# EAGLE schematic BMC2267ltcvV1.0Proto (EAGLE 5.11)
HERSTBEZ: 74451222; MPN: 25C320/SN

## Sheet 1 of 2
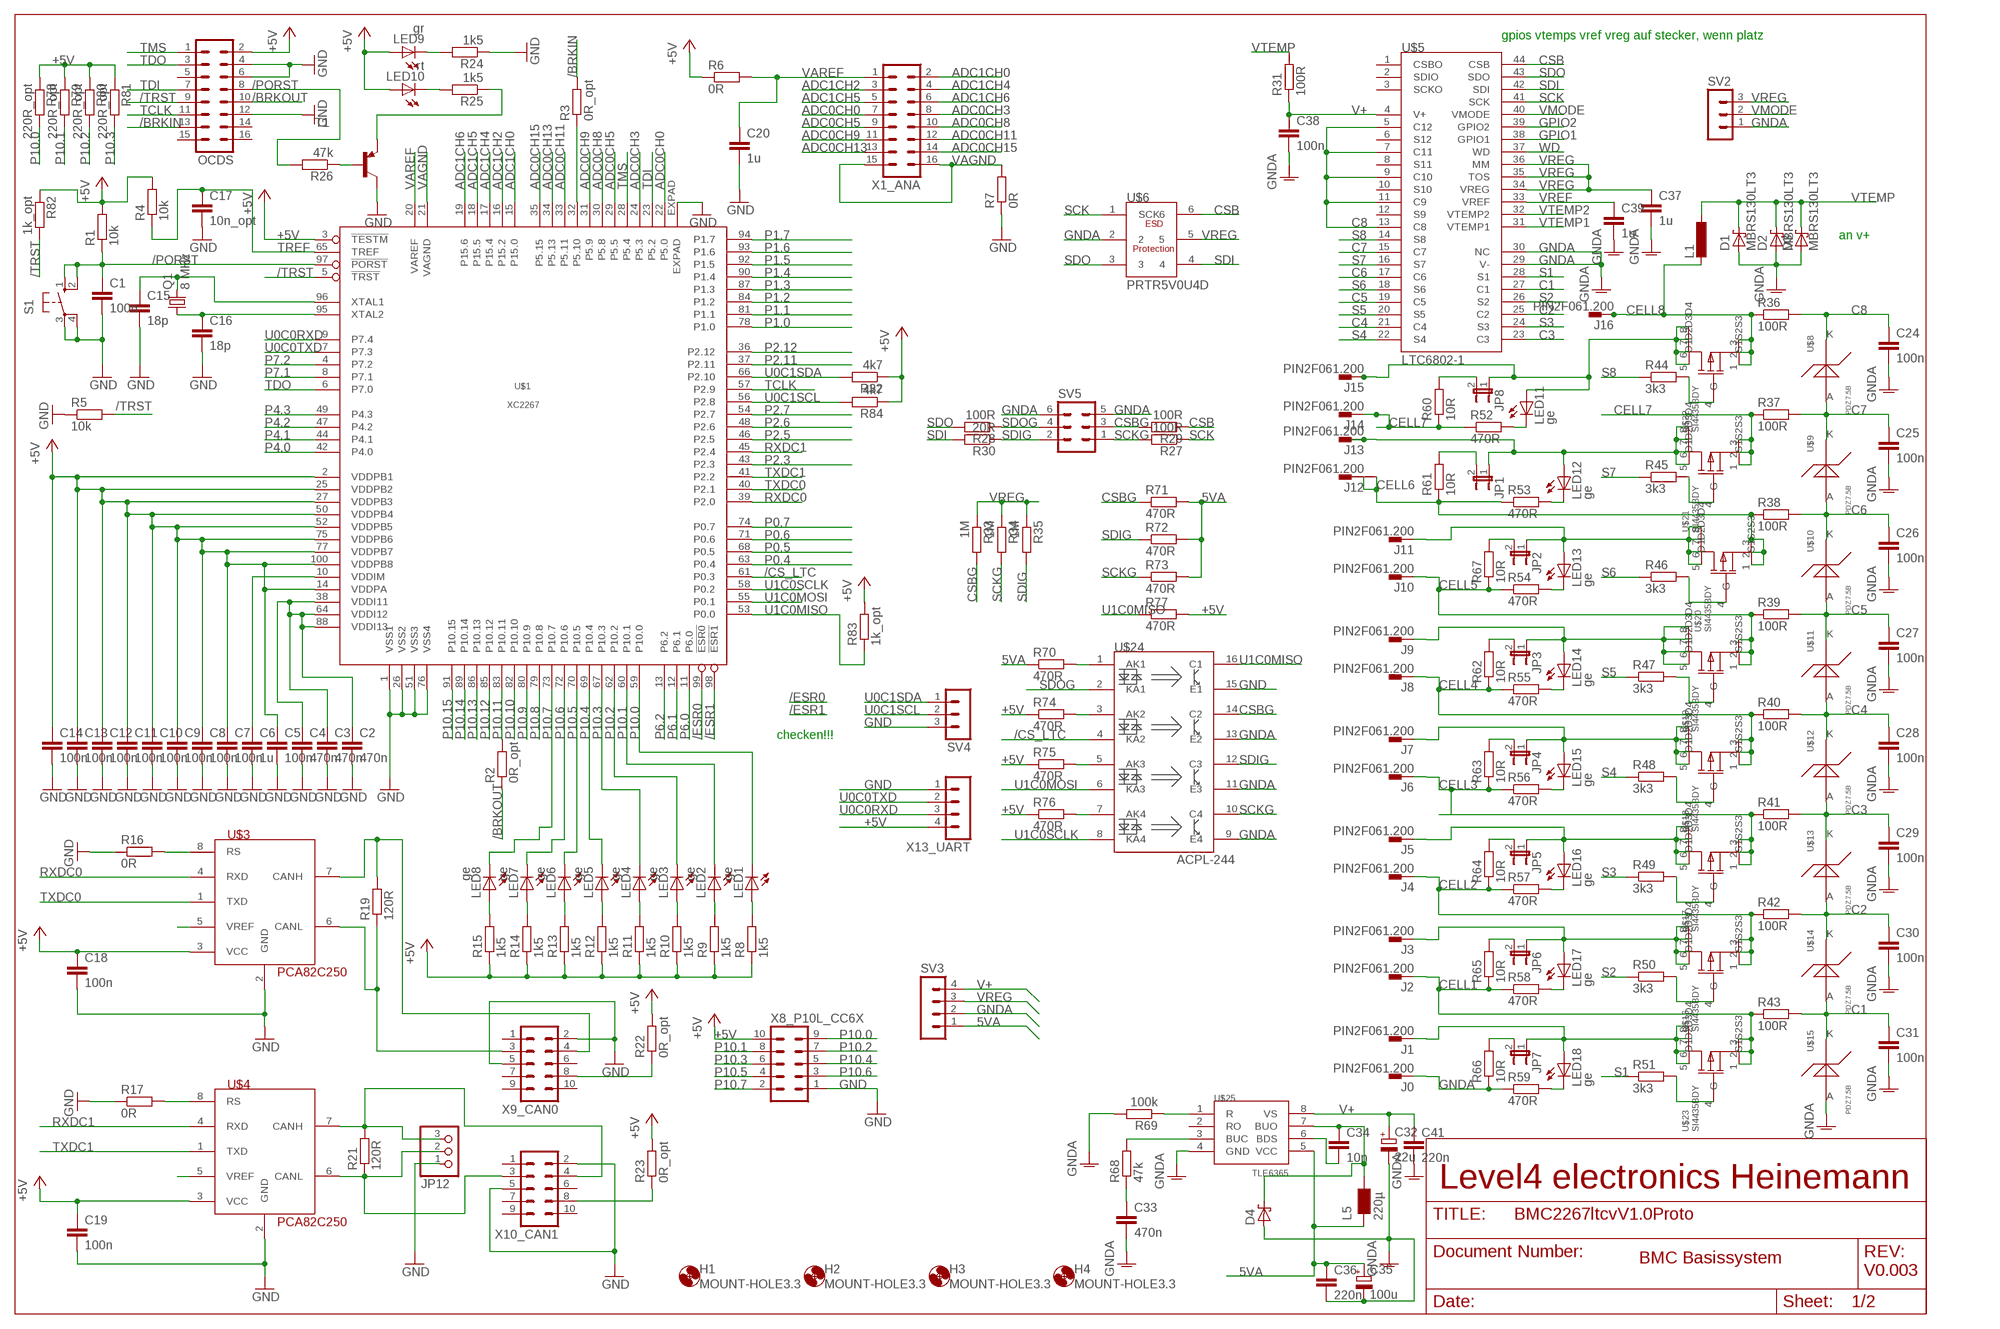
[diagram p0: schematic, sheet 1]

### Parts
C1  100n  C-EUC0805  [C0805]
C2  470n  C-EUC0805  [C0805]
C3  470n  C-EUC0805  [C0805]
C4  470n  C-EUC0805  [C0805]
C5  100n  C-EUC0805  [C0805]
C6  1u  C-EUC0805  [C0805]
C7  100n  C-EUC0603K  [C0603K]
C8  100n  C-EUC0603K  [C0603K]
C9  100n  C-EUC0603K  [C0603K]
C10  100n  C-EUC0603K  [C0603K]
C11  100n  C-EUC0603K  [C0603K]
C12  100n  C-EUC0603K  [C0603K]
C13  100n  C-EUC0603K  [C0603K]
C14  100n  C-EUC0603K  [C0603K]
C15  18p  C-EUC0805  [C0805]
C16  18p  C-EUC0805  [C0805]
C17  10n_opt  C-EUC0805  [C0805]
C18  100n  C-EUC0805  [C0805]
C19  100n  C-EUC0805  [C0805]
C20  1u  C-EUC0805  [C0805]
C24  100n  C-EUC0805  [C0805]
C25  100n  C-EUC0805  [C0805]
C26  100n  C-EUC0805  [C0805]
C27  100n  C-EUC0805  [C0805]
C28  100n  C-EUC0805  [C0805]
C29  100n  C-EUC0805  [C0805]
C30  100n  C-EUC0805  [C0805]
C31  100n  C-EUC0805  [C0805]
C32  22u  CPOL-EUCT6032  [CT6032]
C33  470n  C-EUC0805  [C0805]
C34  10n  C-EUC0805  [C0805]
C35  100u  CPOL-EUCT6032  [CT6032]
C36  220n  C-EUC0805  [C0805]
C37  1u  C-EUC0805  [C0805]
C38  100n  C-EUC0805  [C0805]
C39  1u  C-EUC0805  [C0805]
C41  220n  C-EUC0805  [C0805]
D1  MBRS130LT3  [SMB]
D2  MBRS130LT3  [SMB]
D3  MBRS130LT3  [SMB]
D4  SCHOTTKY-DIODESMD  [SMB]
H1  MOUNT-HOLE3.3  [3,3]
H2  MOUNT-HOLE3.3  [3,3]
H3  MOUNT-HOLE3.3  [3,3]
H4  MOUNT-HOLE3.3  [3,3]
J0  PIN2F061.200  [F061.200]
J1  PIN2F061.200  [F061.200]
J2  PIN2F061.200  [F061.200]
J3  PIN2F061.200  [F061.200]
J4  PIN2F061.200  [F061.200]
J5  PIN2F061.200  [F061.200]
J6  PIN2F061.200  [F061.200]
J7  PIN2F061.200  [F061.200]
J8  PIN2F061.200  [F061.200]
J9  PIN2F061.200  [F061.200]
J10  PIN2F061.200  [F061.200]
J11  PIN2F061.200  [F061.200]
J12  PIN2F061.200  [F061.200]
J13  PIN2F061.200  [F061.200]
J14  PIN2F061.200  [F061.200]
J15  PIN2F061.200  [F061.200]
J16  PIN2F061.200  [F061.200]
JP1  JP1E  [JP1]
JP2  JP1E  [JP1]
JP3  JP1E  [JP1]
JP4  JP1E  [JP1]
JP5  JP1E  [JP1]
JP6  JP1E  [JP1]
JP7  JP1E  [JP1]
JP8  JP1E  [JP1]
JP12  PINHD-1X3/90  [1X03/90]
L1  L-EUL3216C  [L3216C]
L5  220µ  WE-PD3_S  [S]
LED1  ge  LEDCHIP-LED0603  [CHIP-LED0603]
LED2  ge  LEDCHIP-LED0603  [CHIP-LED0603]
LED3  ge  LEDCHIP-LED0603  [CHIP-LED0603]
LED4  ge  LEDCHIP-LED0603  [CHIP-LED0603]
LED5  ge  LEDCHIP-LED0603  [CHIP-LED0603]
LED6  ge  LEDCHIP-LED0603  [CHIP-LED0603]
LED7  ge  LEDCHIP-LED0603  [CHIP-LED0603]
LED8  ge  LEDCHIP-LED0603  [CHIP-LED0603]
LED9  gr  LEDCHIP-LED0603  [CHIP-LED0603]
LED10  rt  LEDCHIP-LED0603  [CHIP-LED0603]
LED11  ge  LEDCHIP-LED0603  [CHIP-LED0603]
LED12  ge  LEDCHIP-LED0603  [CHIP-LED0603]
LED13  ge  LEDCHIP-LED0603  [CHIP-LED0603]
LED14  ge  LEDCHIP-LED0603  [CHIP-LED0603]
LED15  ge  LEDCHIP-LED0603  [CHIP-LED0603]
LED16  ge  LEDCHIP-LED0603  [CHIP-LED0603]
LED17  ge  LEDCHIP-LED0603  [CHIP-LED0603]
LED18  ge  LEDCHIP-LED0603  [CHIP-LED0603]
OCDS  MA08-2  [MA08-2]
Q1  8 MHz  CRYSTALSM49  [SM49]
R1  10k  R-EU_R0805  [R0805]
R2  0R_opt  R-EU_R0805  [R0805]
R3  0R_opt  R-EU_R0805  [R0805]
R4  10k  R-EU_R0805  [R0805]
R5  10k  R-EU_R0805  [R0805]
R6  0R  R-EU_R0805  [R0805]
R7  0R  R-EU_R0805  [R0805]
R8  1k5  R-EU_R0805  [R0805]
R9  1k5  R-EU_R0805  [R0805]
R10  1k5  R-EU_R0805  [R0805]
R11  1k5  R-EU_R0805  [R0805]
R12  1k5  R-EU_R0805  [R0805]
R13  1k5  R-EU_R0805  [R0805]
R14  1k5  R-EU_R0805  [R0805]
R15  1k5  R-EU_R0805  [R0805]
R16  0R  R-EU_R0805  [R0805]
R17  0R  R-EU_R0805  [R0805]
R19  120R  R-EU_R0805  [R0805]
R21  120R  R-EU_R0805  [R0805]
R22  0R_opt  R-EU_R0805  [R0805]
R23  0R_opt  R-EU_R0805  [R0805]
R24  1k5  R-EU_R0805  [R0805]
R25  1k5  R-EU_R0805  [R0805]
R26  47k  R-EU_R0805  [R0805]
R27  100R  R-EU_R0805  [R0805]
R28  100R  R-EU_R0805  [R0805]
R29  100R  R-EU_R0805  [R0805]
R30  20R  R-EU_R0805  [R0805]
R31  100R  R-EU_R0805  [R0805]
R32  4k7  R-EU_R0805  [R0805]
R33  1M  R-EU_R0805  [R0805]
R34  1M  R-EU_R0805  [R0805]
R35  1M  R-EU_R0805  [R0805]
R36  100R  R-EU_R0805  [R0805]
R37  100R  R-EU_R0805  [R0805]
R38  100R  R-EU_R0805  [R0805]
R39  100R  R-EU_R0805  [R0805]
R40  100R  R-EU_R0805  [R0805]
R41  100R  R-EU_R0805  [R0805]
R42  100R  R-EU_R0805  [R0805]
R43  100R  R-EU_R0805  [R0805]
R44  3k3  R-EU_R0805  [R0805]
R45  3k3  R-EU_R0805  [R0805]
R46  3k3  R-EU_R0805  [R0805]
R47  3k3  R-EU_R0805  [R0805]
R48  3k3  R-EU_R0805  [R0805]
R49  3k3  R-EU_R0805  [R0805]
R50  3k3  R-EU_R0805  [R0805]
R51  3k3  R-EU_R0805  [R0805]
R52  470R  R-EU_R0805  [R0805]
R53  470R  R-EU_R0805  [R0805]
R54  470R  R-EU_R0805  [R0805]
R55  470R  R-EU_R0805  [R0805]
R56  470R  R-EU_R0805  [R0805]
R57  470R  R-EU_R0805  [R0805]
R58  470R  R-EU_R0805  [R0805]
R59  470R  R-EU_R0805  [R0805]
R60  10R  R-EU_R2512  [R2512]
R61  10R  R-EU_R2512  [R2512]
R62  10R  R-EU_R2512  [R2512]
R63  10R  R-EU_R2512  [R2512]
R64  10R  R-EU_R2512  [R2512]
R65  10R  R-EU_R2512  [R2512]
R66  10R  R-EU_R2512  [R2512]
R67  10R  R-EU_R2512  [R2512]
R68  47k  R-EU_R0805  [R0805]
R69  100k  R-EU_R0805  [R0805]
R70  470R  R-EU_R0805  [R0805]
R71  470R  R-EU_R0805  [R0805]
R72  470R  R-EU_R0805  [R0805]
R73  470R  R-EU_R0805  [R0805]
R74  470R  R-EU_R0805  [R0805]
R75  470R  R-EU_R0805  [R0805]
R76  470R  R-EU_R0805  [R0805]
R77  470R  R-EU_R0805  [R0805]
R78  220R_opt  R-EU_R0805  [R0805]
R79  220R_opt  R-EU_R0805  [R0805]
R80  220R_opt  R-EU_R0805  [R0805]
R81  220R_opt  R-EU_R0805  [R0805]
R82  1k_opt  R-EU_R0805  [R0805]
R83  1k_opt  R-EU_R0805  [R0805]
R84  4k7  R-EU_R0805  [R0805]
S1  10-XX  [B3F-10XX]
SV2  MA03-1  [MA03-1]
SV3  MA04-1  [MA04-1]
SV4  MA03-1  [MA03-1]
SV5  MA03-2  [MA03-2]
T1  BC858C-PNP-SOT23-BEC  [SOT23-BEC]
U$1  XC2267  [LQFP100]
U$3  PCA82C250  [PDSO8]
U$4  PCA82C250  [PDSO8]
U$5  LTC6802-1  [SSOP44]
U$6  PRTR5V0U4D  [SOT457]
U$8  PDZ7.5B  [SOD323]
U$9  PDZ7.5B  [SOD323]
U$10  PDZ7.5B  [SOD323]
U$11  PDZ7.5B  [SOD323]
U$12  PDZ7.5B  [SOD323]
U$13  PDZ7.5B  [SOD323]
U$14  PDZ7.5B  [SOD323]
U$15  PDZ7.5B  [SOD323]
U$16  SI4435BDY  [SO8]
U$17  SI4435BDY  [SO8]
U$18  SI4435BDY  [SO8]
U$19  SI4435BDY  [SO8]
U$20  SI4435BDY  [SO8]
U$21  SI4435BDY  [SO8]
U$22  SI4435BDY  [SO8]
U$23  SI4435BDY  [SO8]
U$24  ACPL-244  [SO16]
U$25  TLE6365  [PDSO8]
X1_ANA  MA08-2  [MA08-2]
X8_P10L_CC6X  MA05-2  [MA05-2]
X9_CAN0  MA05-2  [MA05-2]
X10_CAN1  MA05-2  [MA05-2]
X13_UART  MA04-1  [MA04-1]

### Nets
5VA: C35.+ C36.1 L5.2 R70.1 R71.2 R72.2 R73.2 SV3.1 U$25.5(VCC)
+5V: C5.1 C7.1 C8.1 C9.1 C10.1 C11.1 C12.1 C13.1 C14.1 C18.1 C19.1 LED9.A LED10.A OCDS.2 R1.2 R4.2 R6.1 R8.1 R9.1 R10.1 R11.1 R12.1 R13.1 R14.1 R15.1 R22.2 R23.2 R32.1 R74.1 R75.1 R76.1 R77.2 R78.1 R79.1 R80.1 R81.1 R82.1 R83.2 R84.1 U$1.2(VDDPB1) U$1.3(!TESTM) U$1.14(VDDPA) U$1.25(VDDPB2) U$1.27(VDDPB3) U$1.50(VDDPB4) U$1.52(VDDPB5) U$1.75(VDDPB6) U$1.77(VDDPB7) U$1.100(VDDPB8) U$3.3(VCC) U$4.3(VCC) X8_P10L_CC6X.10 X13_UART.4 ; also sheet 2
/BRKIN: OCDS.13 R3.2
/BRKOUT: OCDS.10 R2.1
/CS_LTC: U$1.61(P0.3) U$24.4(KA2)
/ESR0: U$1.99(!ESR0)
/ESR1: U$1.98(!ESR1)
/PORST: C1.1 OCDS.8 R1.1 R26.2 S1.1(S) S1.2(S1) U$1.97(!PORST)
/TRST: OCDS.9 R5.2 R82.2 U$1.5(!TRST)
ADC0CH0: U$1.22(P5.0) X1_ANA.7
ADC0CH3: U$1.24(P5.3) X1_ANA.8
ADC0CH5: U$1.29(P5.5) X1_ANA.9
ADC0CH8: U$1.30(P5.8) X1_ANA.10
ADC0CH9: U$1.31(P5.9) X1_ANA.11
ADC0CH11: U$1.33(P5.11) X1_ANA.12
ADC0CH13: U$1.34(P5.13) X1_ANA.13
ADC0CH15: U$1.35(P5.15) X1_ANA.14
ADC1CH0: U$1.15(P15.0) X1_ANA.2
ADC1CH2: U$1.16(P15.2) X1_ANA.3
ADC1CH4: U$1.17(P15.4) X1_ANA.4
ADC1CH5: U$1.18(P15.5) X1_ANA.5
ADC1CH6: U$1.19(P15.6) X1_ANA.6
C1: C31.1 R43.2 U$5.27(C1) U$14.A U$15.K
C2: C30.1 R42.2 U$5.25(C2) U$13.A U$14.K
C3: C29.1 R41.2 U$5.23(C3) U$12.A U$13.K
C4: C28.1 R40.2 U$5.21(C4) U$11.A U$12.K
C5: C27.1 R39.2 U$5.19(C5) U$10.A U$11.K
C6: C26.1 R38.2 U$5.17(C6) U$9.A U$10.K
C7: C25.1 R37.2 U$5.15(C7) U$8.A U$9.K
C8: C24.1 R36.2 U$5.5(C12) U$5.7(C11) U$5.9(C10) U$5.11(C9) U$5.13(C8) U$8.K
CELL1: J2.1A J2.1B(1.1) R43.1 R58.1 R65.1 U$23.1(S1) U$23.2(S2) U$23.3(S3)
CELL2: J4.1A J4.1B(1.1) R42.1 R57.1 R64.1 U$16.1(S1) U$16.2(S2) U$16.3(S3)
CELL3: J6.1A J6.1B(1.1) R41.1 R56.1 R63.1 U$17.1(S1) U$17.2(S2) U$17.3(S3)
CELL4: J8.1A J8.1B(1.1) R40.1 R55.1 R62.1 U$18.1(S1) U$18.2(S2) U$18.3(S3)
CELL5: J10.1A J10.1B(1.1) R39.1 R54.1 R67.1 U$19.1(S1) U$19.2(S2) U$19.3(S3)
CELL6: J12.1A J12.1B(1.1) R38.1 R53.1 R61.1 U$20.1(S1) U$20.2(S2) U$20.3(S3)
CELL7: J14.1A J14.1B(1.1) R37.1 R52.1 R60.1 U$21.1(S1) U$21.2(S2) U$21.3(S3)
CELL8: J16.1A J16.1B(1.1) L1.2 R36.1 U$22.1(S1) U$22.2(S2) U$22.3(S3)
CSB: R29.1 U$5.44(CSB) U$6.6
CSBG: R29.2 R33.2 R71.1 SV5.3 U$24.14(C2)
GND: C1.2 C2.2 C3.2 C4.2 C5.2 C6.2 C7.2 C8.2 C9.2 C10.2 C11.2 C12.2 C13.2 C14.2 C15.2 C16.2 C17.2 C18.2 C19.2 C20.2 JP12.1 OCDS.4 OCDS.6 OCDS.12 R5.1 R7.1 R16.1 R17.1 R24.1 S1.3(P) S1.4(P1) SV4.3 T1.C U$1.1(VSS1) U$1.26(VSS2) U$1.51(VSS3) U$1.76(VSS4) U$1.EXPAD U$3.2(GND) U$4.2(GND) U$24.15(E1) X8_P10L_CC6X.1 X9_CAN0.2 X9_CAN0.5 X10_CAN1.2 X10_CAN1.5 X13_UART.1 ; also sheet 2
GNDA: C24.2 C25.2 C26.2 C27.2 C28.2 C29.2 C30.2 C31.2 C32.- C33.2 C35.- C36.2 C37.2 C38.2 C39.2 C41.2 D1.A D2.A D3.A D4.A J0.1A J0.1B(1.1) R59.1 R66.1 R69.2 SV2.1 SV3.2 SV5.5 SV5.6 U$5.29(V-) U$5.30(NC) U$6.2 U$15.A U$24.9(E4) U$24.11(E3) U$24.13(E2) U$25.4(GND)
GPIO1: U$5.38(GPIO1)
GPIO2: U$5.39(GPIO2)
N$1: R3.1 U$1.32(P5.10)
N$2: LED8.A R15.2
N$3: LED7.A R14.2
N$4: C2.1 C3.1 C4.1 U$1.38(VDDI11) U$1.64(VDDI12) U$1.88(VDDI13)
N$5: LED6.A R13.2
N$6: LED5.A R12.2
N$7: LED4.A R11.2
N$8: LED3.A R10.2
N$9: LED9.C R24.2
N$10: LED2.A R9.2
N$11: LED1.A R8.2
N$12: R17.2 U$4.8(RS)
N$13: R16.2 U$3.8(RS)
N$14: JP12.3 R21.2 U$4.7(CANH) X10_CAN1.4
N$15: R23.1 X10_CAN1.8
N$16: R25.1 T1.E
N$17: LED10.C R25.2
N$18: JP12.2 R21.1 U$4.6(CANL) X10_CAN1.3
N$19: R22.1 X9_CAN0.8
N$20: R19.2 U$3.7(CANH) X9_CAN0.4
N$21: C6.1 U$1.10(VDDIM)
N$22: U$4.5(VREF)
N$24: R19.1 U$3.6(CANL) X9_CAN0.3
N$25: R26.1 T1.B
N$26: U$3.5(VREF)
N$28: R74.2 U$24.3(AK2)
N$29: R75.2 U$24.5(AK3)
N$30: R76.2 U$24.7(AK4)
N$34: R70.2 U$24.1(AK1)
N$35: C15.1 Q1.2 U$1.96(XTAL1)
N$36: C16.1 Q1.1 U$1.95(XTAL2)
N$40: R51.2 U$23.4(G)
N$41: J15.1A J15.1B(1.1) JP8.1 LED11.A U$22.5(D1) U$22.6(D2) U$22.7(D3) U$22.8(D4)
N$42: R45.2 U$21.4(G)
N$43: J13.1A J13.1B(1.1) JP1.1 LED12.A U$21.5(D1) U$21.6(D2) U$21.7(D3) U$21.8(D4)
N$44: R47.2 U$19.4(G)
N$45: J11.1A J11.1B(1.1) JP2.1 LED13.A U$20.5(D1) U$20.6(D2) U$20.7(D3) U$20.8(D4)
N$46: R46.2 U$20.4(G)
N$47: J9.1A J9.1B(1.1) JP3.1 LED14.A U$19.5(D1) U$19.6(D2) U$19.7(D3) U$19.8(D4)
N$48: R44.2 U$22.4(G)
N$49: J7.1A J7.1B(1.1) JP4.1 LED15.A U$18.5(D1) U$18.6(D2) U$18.7(D3) U$18.8(D4)
N$51: R48.2 U$18.4(G)
N$52: R49.2 U$17.4(G)
N$53: R50.2 U$16.4(G)
N$58: C33.1 R68.1
N$59: R68.2 U$25.3(BUC)
N$61: R69.1 U$25.1(R)
N$62: J5.1A J5.1B(1.1) JP5.1 LED16.A U$17.5(D1) U$17.6(D2) U$17.7(D3) U$17.8(D4)
N$63: J3.1A J3.1B(1.1) JP6.1 LED17.A U$16.5(D1) U$16.6(D2) U$16.7(D3) U$16.8(D4)
N$64: J1.1A J1.1B(1.1) JP7.1 LED18.A U$23.5(D1) U$23.6(D2) U$23.7(D3) U$23.8(D4)
N$65: LED18.C R59.2
N$66: LED17.C R58.2
N$67: LED16.C R57.2
N$68: LED15.C R56.2
N$69: LED14.C R55.2
N$70: LED13.C R54.2
N$71: LED12.C R53.2
N$72: LED11.C R52.2
N$73: JP2.2 R67.2
N$74: JP3.2 R62.2
N$76: C34.1 D4.C L5.1 U$25.7(BUO)
N$77: C34.2 U$25.6(BDS)
N$78: JP4.2 R63.2
N$79: JP5.2 R64.2
N$81: JP6.2 R65.2
N$83: JP7.2 R66.2
N$86: JP1.2 R61.2
N$88: JP8.2 R60.2
P0.4: U$1.63(P0.4)
P0.5: U$1.68(P0.5)
P0.6: U$1.71(P0.6)
P0.7: U$1.74(P0.7)
P1.0: U$1.78(P1.0)
P1.1: U$1.81(P1.1)
P1.2: U$1.84(P1.2)
P1.3: U$1.87(P1.3)
P1.4: U$1.90(P1.4)
P1.5: U$1.92(P1.5)
P1.6: U$1.93(P1.6)
P1.7: U$1.94(P1.7)
P2.3: U$1.43(P2.3)
P2.5: U$1.46(P2.5)
P2.6: U$1.48(P2.6)
P2.7: U$1.54(P2.7) ; also sheet 2
P2.11: U$1.37(P2.11)
P2.12: U$1.36(P2.12)
P4.0: U$1.42(P4.0)
P4.1: U$1.44(P4.1)
P4.2: U$1.47(P4.2)
P4.3: U$1.49(P4.3)
P6.0: U$1.11(P6.0)
P6.1: U$1.12(P6.1)
P6.2: U$1.13(P6.2)
P7.1: U$1.8(P7.1)
P7.2: U$1.4(P7.2)
P10.0: LED1.C R78.2 U$1.59(P10.0) X8_P10L_CC6X.9 ; also sheet 2
P10.1: LED2.C R79.2 U$1.60(P10.1) X8_P10L_CC6X.8
P10.2: LED3.C R80.2 U$1.62(P10.2) X8_P10L_CC6X.7
P10.3: LED4.C R81.2 U$1.67(P10.3) X8_P10L_CC6X.6
P10.4: LED5.C U$1.69(P10.4) X8_P10L_CC6X.5
P10.5: LED6.C U$1.70(P10.5) X8_P10L_CC6X.4 ; also sheet 2
P10.6: LED7.C U$1.72(P10.6) X8_P10L_CC6X.3
P10.7: LED8.C U$1.73(P10.7) X8_P10L_CC6X.2 ; also sheet 2
P10.8: U$1.79(P10.8)
P10.9: U$1.80(P10.9)
P10.10: U$1.82(P10.10)
P10.11: R2.2 U$1.83(P10.11)
P10.12: U$1.85(P10.12)
P10.13: U$1.86(P10.13)
P10.14: U$1.89(P10.14)
P10.15: U$1.91(P10.15)
RXDC0: U$1.39(P2.0) U$3.4(RXD)
RXDC1: U$1.45(P2.4) U$4.4(RXD)
S1: R51.1 U$5.28(S1)
S2: R50.1 U$5.26(S2)
S3: R49.1 U$5.24(S3)
S4: R48.1 U$5.22(S4)
S5: R47.1 U$5.20(S5)
S6: R46.1 U$5.18(S6)
S7: R45.1 U$5.16(S7)
S8: R44.1 U$5.14(S8)
SCK: R27.1 U$5.41(SCK) U$6.1(SCK)
SCKG: R27.2 R34.2 R73.1 SV5.1 U$24.10(C4)
SDI: R30.2 U$5.42(SDI) U$6.4
SDIG: R30.1 R35.2 R72.1 SV5.2 U$24.12(C3)
SDO: R28.2 U$5.43(SDO) U$6.3
SDOG: R28.1 SV5.4 U$24.2(KA1)
TCLK: OCDS.11 U$1.57(P2.9)
TDI: OCDS.7 U$1.23(P5.2)
TDO: OCDS.3 U$1.6(P7.0)
TMS: OCDS.1 U$1.28(P5.4)
TREF: C17.1 R4.1 U$1.65(TREF)
TXDC0: U$1.40(P2.1) U$3.1(TXD)
TXDC1: U$1.41(P2.2) U$4.1(TXD)
U0C0RXD: U$1.9(P7.4) X13_UART.3
U0C0TXD: U$1.7(P7.3) X13_UART.2
U0C1SCL: R84.2 SV4.2 U$1.56(P2.8)
U0C1SDA: R32.2 SV4.1 U$1.66(P2.10)
U1C0MISO: R77.1 R83.1 U$1.53(P0.0) U$24.16(C1)
U1C0MOSI: U$1.55(P0.1) U$24.6(KA3)
U1C0SCLK: U$1.58(P0.2) U$24.8(KA4)
V+: C32.+ C38.1 C41.1 R31.1 SV3.4 U$5.4(V+) U$25.8(VS)
VAGND: R7.2 U$1.21(VAGND) X1_ANA.15 X1_ANA.16
VAREF: C20.1 R6.2 U$1.20(VAREF) X1_ANA.1
VMODE: SV2.2 U$5.40(VMODE)
VREF: C39.1 U$5.33(VREF)
VREG: C37.1 R33.1 R34.1 R35.1 SV2.3 SV3.3 U$5.34(VREG) U$5.35(TOS) U$5.36(MM) U$6.5
VTEMP: D1.C D2.C D3.C L1.1 R31.2
VTEMP1: U$5.31(VTEMP1)
VTEMP2: U$5.32(VTEMP2)
WD: U$5.37(WD)
Unconnected: OCDS.5 OCDS.14 OCDS.15 OCDS.16 U$5.1(CSBO) U$5.2(SDIO) U$5.3(SCKO) U$5.6(S12) U$5.8(S11) U$5.10(S10) U$5.12(S9) U$25.2(RO) X9_CAN0.1 X9_CAN0.6 X9_CAN0.7 X9_CAN0.9 X9_CAN0.10 X10_CAN1.1 X10_CAN1.6 X10_CAN1.7 X10_CAN1.9 X10_CAN1.10

### Notes on the sheet
- gpios vtemps vref vreg auf stecker, wenn platz
- an v+
- checken!!!
- Level4 electronics Heinemann
- BMC Basissystem
- V0.003

## Sheet 2 of 2
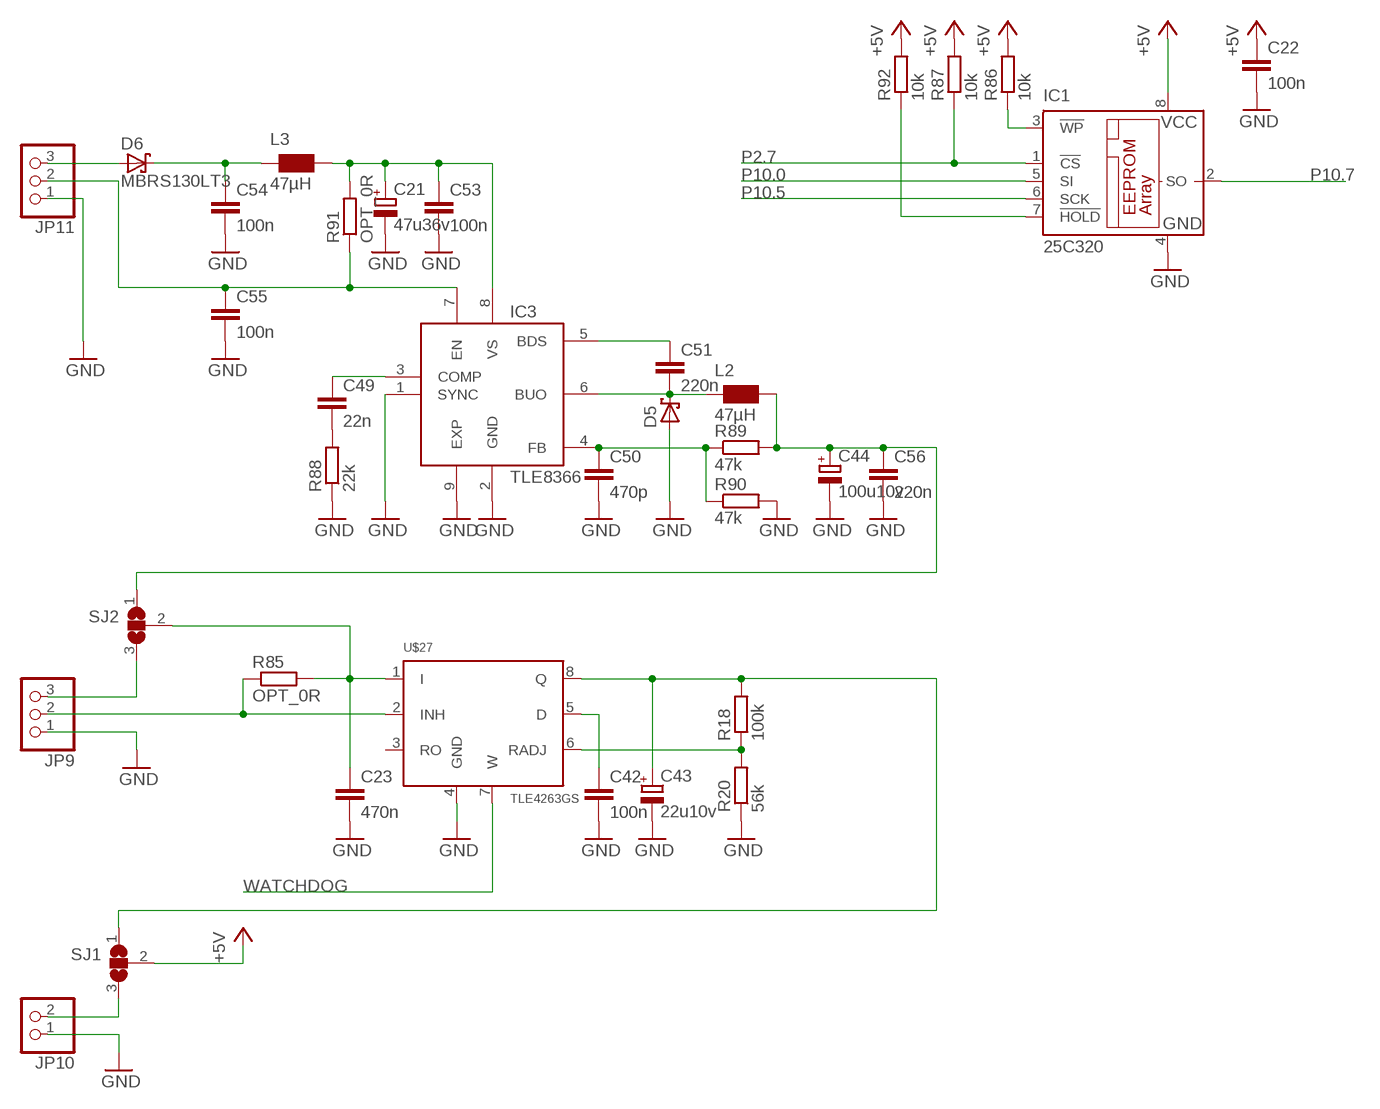
[diagram p1: schematic, sheet 2]

### Parts
C21  47u36v  CPOL-EU153CLV-0605  [153CLV-0605]
C22  100n  C-EUC0805  [C0805]
C23  470n  C-EUC0805  [C0805]
C42  100n  C-EUC0805  [C0805]
C43  22u10v  CPOL-EU153CLV-0505  [153CLV-0505]
C44  100u10v  CPOL-EU153CLV-0605  [153CLV-0605]
C49  22n  C-EUC0805  [C0805]
C50  470p  C-EUC0805  [C0805]
C51  220n  C-EUC0805  [C0805]
C53  100n  C-EUC0805  [C0805]
C54  100n  C-EUC0805  [C0805]
C55  100n  C-EUC0805  [C0805]
C56  220n  C-EUC0805  [C0805]
D5  SCHOTTKY-DIODESMD  [SMB]
D6  MBRS130LT3  [SMB]
IC1  25C320  25AA080SN  [SO-08]
IC3  TLE8366  [SO8-EXP]
JP9  PINHD-1X3/90  [1X03/90]
JP10  PINHD-1X2  [1X02]
JP11  PINHD-1X3/90  [1X03/90]
L2  47µH  WE-PD2_L  [WE-PD2_L]
L3  47µH  WE-PD2_L  [WE-PD2_L]
R18  100k  R-EU_R0805  [R0805]
R20  56k  R-EU_R0805  [R0805]
R85  OPT_0R  R-EU_R0805  [R0805]
R86  10k  R-EU_R0805  [R0805]
R87  10k  R-EU_R0805  [R0805]
R88  22k  R-EU_R0805  [R0805]
R89  47k  R-EU_R0805  [R0805]
R90  47k  R-EU_R0805  [R0805]
R91  OPT_0R  R-EU_R0805  [R0805]
R92  10k  R-EU_R0805  [R0805]
SJ1  SJ2W  [SJ_2]
SJ2  SJ2W  [SJ_2]
U$27  TLE4263GS  [SO8]

### Nets
+5V: C22.1 IC1.8(VCC) R86.2 R87.2 R92.2 SJ1.2 ; also sheet 1
GND: C21.- C22.2 C23.2 C42.2 C43.- C44.- C50.2 C53.2 C54.2 C55.2 C56.2 D5.A IC1.4(GND) IC3.1(SYNC) IC3.2(GND) IC3.9(EXP) JP9.1 JP10.1 JP11.1 R20.1 R88.1 R90.2 U$27.4(GND) ; also sheet 1
LIN5V: C43.+ R18.2 SJ1.1 U$27.8(Q)
N$23: C42.1 U$27.5(D)
N$27: IC1.3(!WP) R86.1
N$31: C23.1 R85.2 SJ2.2 U$27.1(I)
N$32: R18.1 R20.2 U$27.6(RADJ)
N$33: JP9.2 R85.1 U$27.2(INH)
N$37: JP9.3 SJ2.3
N$38: JP10.2 SJ1.3
N$50: IC1.7(!HOLD) R92.1
N$55: C49.2 R88.2
N$56: C49.1 IC3.3(COMP)
N$57: C50.1 IC3.4(FB) R89.1 R90.1
N$60: C51.1 IC3.5(BDS)
N$75: C51.2 D5.C IC3.6(BUO) L2.2
N$80: C44.+ C56.1 L2.1 R89.2 SJ2.1
N$82: C21.+ C53.1 IC3.8(VS) L3.1 R91.2
N$84: C55.1 IC3.7(EN) JP11.2 R91.1
N$85: C54.1 D6.C L3.2
N$87: D6.A JP11.3
P2.7: IC1.1(!CS) R87.1 ; also sheet 1
P10.0: IC1.5(SI) ; also sheet 1
P10.5: IC1.6(SCK) ; also sheet 1
P10.7: IC1.2(SO) ; also sheet 1
WATCHDOG: U$27.7(W)
Unconnected: U$27.3(RO)

## Library data of the parts
C1-C20 C22-C31 C33 C34 C36-C39 C41 C42 C49-C51 C53-C56 = rcl:C-EU: CAPACITOR, European symbol
C21 C32 C35 C43 C44 = rcl:CPOL-EU: POLARIZED CAPACITOR, European symbol
D1-D3 D6 = diode:MBRS130LT3: Schottky Power Rectifier Source: http://www.onsemi.com/pub/Collateral/MBRS130LT3-D.PDF
D4 D5 = diode:SCHOTTKY-DIODE: Schottky Diode
H1-H4 = holes:MOUNT-HOLE: MOUNTING HOLE with drill center marker
IC1 = microchip:25*: Serial EEPROM 4K/ 8K , SPI bus; MF: MICROCHIP; MPN: 25AA080/SN; OC_FARNELL: 1816072; OC_NEWARK: 92C7351
IC3 = infineon:TLE8366
J0 J1-J16 = con-faston:PIN2: Flachstecker Typ Tyco/Electronics/AMP TAB, FASTON Printed Circuit Board Tabs Source: http://www.buerklin.com, http://catalog.tycoelectronics.com; OC_FARNELL: unknown; OC_NEWARK: unknown
JP1-JP8 = jumper:JP1E: JUMPER
JP9 JP11 JP12 = pinhead:PINHD-1X3: PIN HEADER
JP10 = pinhead:PINHD-1X2: PIN HEADER
L1 = rcl:L-EU: INDUCTOR, European symbol
L2 L3 = wuerth-elektronik:WE-PD2: SMD-Power Inductors WE-PD2 Is recommended for the application with switching regulators from National Semiconductor, Linear Technology, Texas Instruments and Fairchild Semiconductor -- Switching regulators with low operating voltages (computer, laptop, mobile phones, pagers) -- Integrated DC/DC-converter
L5 = wuerth-elektronik:WE-PD3: SMD-Shielded Power Inductor WE-PD3 Is recommended for the application with switching regulators from National Semiconductor, Linear Technology, Texas Instruments and Fairchild Semiconductor - Magnetically shielded version which results in a low leakage field - High storage capacity - Low inherent-losses - Extremely low profile of type M: 2,7mm
LED1-LED18 = led:LED: LED OSRAM: - CHIPLED LG R971, LG N971, LY N971, LG Q971, LY Q971, LO R971, LY R971 LH N974, LH R974 LS Q976, LO Q976, LY Q976 LO Q996 - Hyper CHIPLED LW Q18S LB Q993, LB Q99A, LB R99A - SideLED LS A670, LO A670, LY A670, LG A670, LP A670 LB A673, LV A673, LT A673, LW A673 LH A674 LY A675 LS A676, LA A676, LO A676, LY A676, LW A676 LS A679, LY A679, LG A679 - Hyper Micro SIDELED® LS Y876, LA Y876, LO Y876, LY Y876 LT Y87S - SmartLED LW L88C, LW L88S LB L89C, LB L89S, LG L890 LS L89K, LO L89K, LY L89K LS L896, LA L896, LO L896, LY L896 - TOPLED LS T670, LO T670, LY T670, LG T670, LP T670 LSG T670, LSP T670, LSY T670, LOP T670, LYG T670 LG T671, LOG T671, LSG T671 LB T673, LV T673, LT T673, LW T673 LH T674 LS T676, LA T676, LO T676, LY T676, LB T676, LH T676, LSB T676, LW T676 LB T67C, LV T67C, LT T67C, LS T67K, LO T67K, LY T67K, LW E67C LS E67B, LA E67B, LO E67B, LY E67B, LB E67C, LV E67C, LT E67C LW T67C LS T679, LY T679, LG T679 LS T770, LO T770, LY T770, LG T770, LP T770 LB T773, LV T773, LT T773, LW T773 LH T774 LS E675, LA E675, LY E675, LS T675 LS T776, LA T776, LO T776, LY T776, LB T776 LHGB T686 LT T68C, LB T68C - Hyper Mini TOPLED® LB M676 - Mini TOPLED Santana® LG M470 LS M47K, LO M47K, LY M47K Source: http://www.osram.convergy.de LUXEON: - LUMILED® LXK2-PW12-R00, LXK2-PW12-S00, LXK2-PW14-U00, LXK2-PW14-V00 LXK2-PM12-R00, LXK2-PM12-S00, LXK2-PM14-U00 LXK2-PE12-Q00, LXK2-PE12-R00, LXK2-PE12-S00, LXK2-PE14-T00, LXK2-PE14-U00 LXK2-PB12-K00, LXK2-PB12-L00, LXK2-PB12-M00, LXK2-PB14-N00, LXK2-PB14-P00, LXK2-PB14-Q00 LXK2-PR12-L00, LXK2-PR12-M00, LXK2-PR14-Q00, LXK2-PR14-R00 LXK2-PD12-Q00, LXK2-PD12-R00, LXK2-PD12-S00 LXK2-PH12-R00, LXK2-PH12-S00 LXK2-PL12-P00, LXK2-PL12-Q00, LXK2-PL12-R00 Source: www.luxeon.com KINGBRIGHT: KA-3528ASYC Source: www.kingbright.com
OCDS X1_ANA = con-lstb:MA08-2: PIN HEADER; OC_FARNELL: unknown; OC_NEWARK: unknown
Q1 = crystal:CRYSTAL: CRYSTAL; OC_FARNELL: unknown; OC_NEWARK: unknown
R1-R92 = rcl:R-EU_: RESISTOR, European symbol
S1 = switch-omron:10-XX: OMRON SWITCH; MPN: B3F-1000; OC_FARNELL: 176432; OC_NEWARK: 36M3542
SJ1 SJ2 = jumper:SJ2W: SMD solder JUMPER
SV2 SV4 = con-lstb:MA03-1: PIN HEADER; OC_FARNELL: unknown; OC_NEWARK: unknown
SV3 X13_UART = con-lstb:MA04-1: PIN HEADER; OC_FARNELL: unknown; OC_NEWARK: unknown
SV5 = con-lstb:MA03-2: PIN HEADER; OC_FARNELL: unknown; OC_NEWARK: unknown
T1 = transistor:*-PNP-: PNP Transistror
U$1 = BMSlib:XC2267
U$3 U$4 = BMSlib:PCA82C250
U$5 = BMSlib:LTC6802-1
U$6 = BMSlib:PRTR5V0U4D
U$8-U$15 = BMSlib:PDZ7.5B
U$16-U$23 = BMSlib:SI4435BDY
U$24 = BMSlib:ACPL-244
U$25 = BMSlib:TLE6365
U$27 = infineon:TLE4263GS
X8_P10L_CC6X X9_CAN0 X10_CAN1 = con-lstb:MA05-2: PIN HEADER; OC_FARNELL: unknown; OC_NEWARK: unknown